# Altium schematic sheet Digpot_load_cell_alim.SchDoc
size A; SheetNumber: 1; SheetTotal: 7
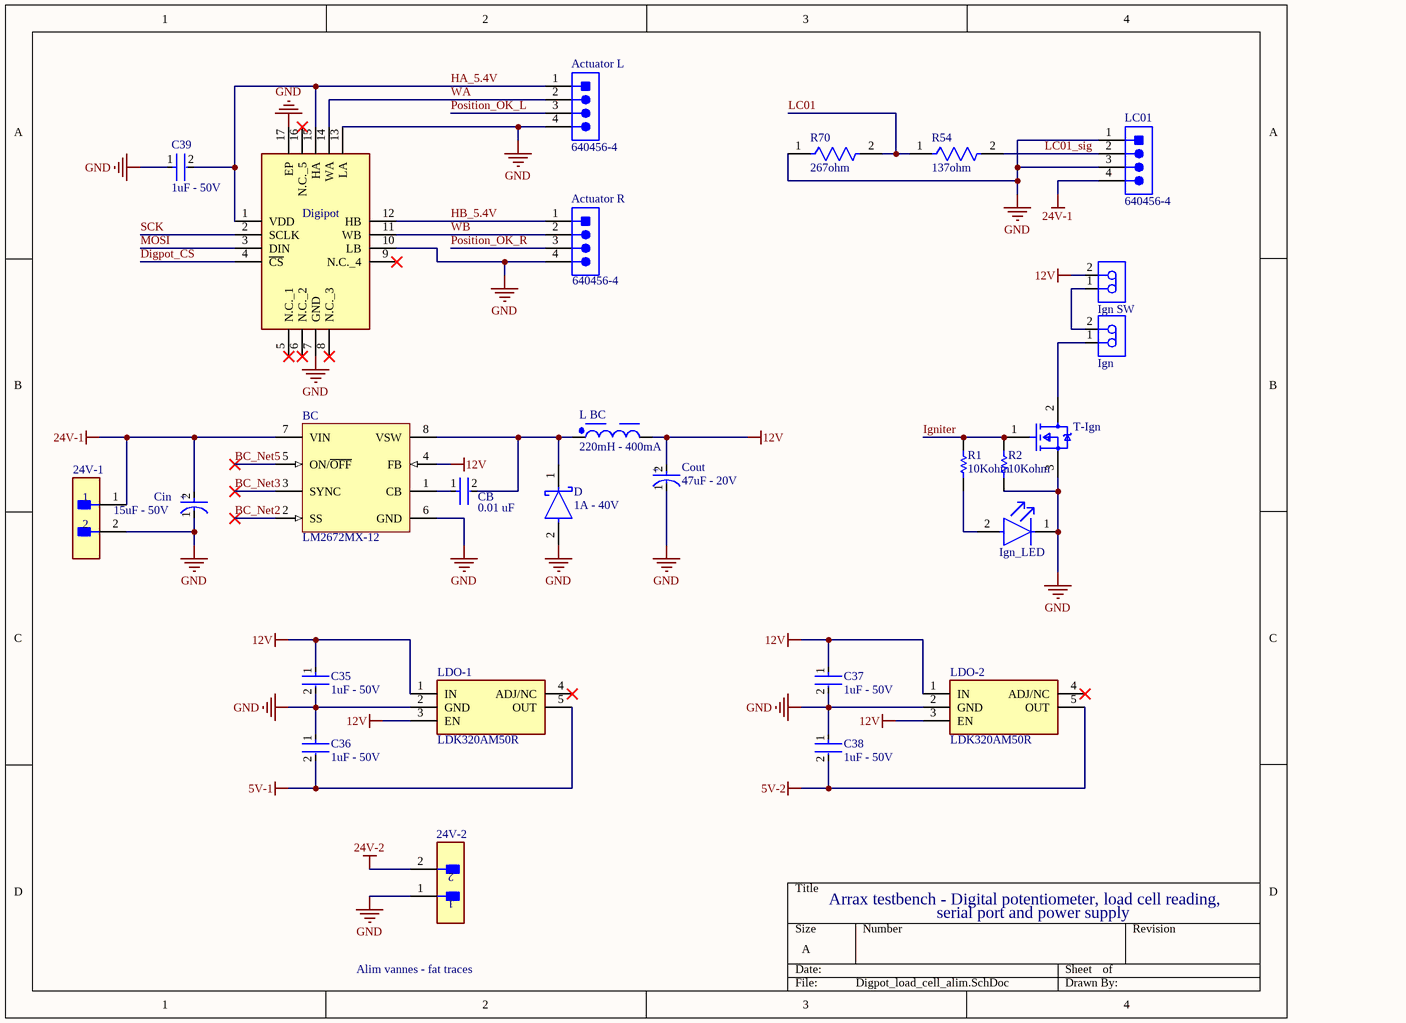
[diagram p0: Digpot_load_cell_alim.SchDoc]

## Parts
24V-1  (no value)  [FP-B2P-VH-FB-B_LF_SN-MFG]
24V-2  (no value)  [FP-B2P-VH-FB-B_LF_SN-MFG]
Actuator_L  640456-4  [TECO-640456-4]
Actuator_R  640456-4  [TECO-640456-4]
BC  LM2672MX-12  [M08A_L]
C35  1uF - 50V  [FP-0805-L_2_0_0_1-W_1_25-MFG]
C36  1uF - 50V  [FP-0805-L_2_0_0_1-W_1_25-MFG]
C37  1uF - 50V  [FP-0805-L_2_0_0_1-W_1_25-MFG]
C38  1uF - 50V  [FP-0805-L_2_0_0_1-W_1_25-MFG]
C39  1uF - 50V  [FP-0805-L_2_0_0_1-W_1_25-MFG]
CB  0.01 uF  [FP-CC0805-0_85-MFG]
Cin  15uF - 50V  [FP-TAJD-MFG]
Cout  47uF - 20V  [FP-TAJD-MFG]
D  1A - 40V  [FP-SOD-323-IPC_C]
Digipot  TPL0202-10MRTER  [QFN50P300X300X80-17N-D]  (value not drawn)
Ign  640456-2  [TECO-640456-2_V]  (value not drawn)
Ign_LED  LS R976-NR-1  [FP-LS_R976-MFG]  (value not drawn)
Ign_SW  640456-2  [TECO-640456-2_V]  (value not drawn)
L_BC  220mH - 400mA  [WE-LQFS_4828]
LC01  640456-4  [TECO-640456-4]
LDO-1  LDK320AM50R  [SOT95P280X145-5N]
LDO-2  LDK320AM50R  [SOT95P280X145-5N]
R1  10Kohm  [RESC2013X60X30NL20T20]
R2  10Kohm  [RESC2013X60X30NL20T20]
R54  137ohm  [FP-RP73P-2A-MFG]
R70  267ohm  [FP-RP73P-2A-MFG]
T-Ign  IRLZ44NPbF  [FP-PG-TO220-3-MFG]  (value not drawn)

## Nets
5V-1: C36.2 LDO-1.5(OUT)
5V-2: C38.2 LDO-2.5(OUT)
12V: BC.4(FB) C35.1 C37.1 Cout.2(A) Ign_SW.2 L_BC.2 LDO-1.1(IN) LDO-1.3(EN) LDO-2.1(IN) LDO-2.3(EN)
24V-1: 24V-1.1 BC.7(VIN) Cin.2(A) LC01.4
24V-2: 24V-2.2
GND: 24V-1.2 24V-2.1 Actuator_L.4 Actuator_R.4 BC.6(GND) C35.2 C36.1 C37.2 C38.1 C39.1 Cin.1(C) Cout.1(C) D.2(A) Digipot.7(GND) Digipot.10(LB) Digipot.13(LA) Digipot.17(EP) Ign_LED.1(C) LC01.1 LC01.3 LDO-1.2(GND) LDO-2.2(GND) R2.1 R70.1 T-Ign.3(S)
BC_Net2: BC.2(SS)
BC_Net3: BC.3(SYNC)
BC_Net5: BC.5(ON/~{OFF})
Digpot_CS: Digipot.4(~{CS})
HA_5.4V: Actuator_L.1 C39.2 Digipot.1(VDD) Digipot.15(HA)
HB_5.4V: Actuator_R.1 Digipot.12(HB)
Igniter: R1.2 R2.2 T-Ign.1(G)
LC01: R54.1 R70.2
LC01_sig: LC01.2 R54.2
MOSI: Digipot.3(DIN)
Position_OK_L: Actuator_L.3
Position_OK_R: Actuator_R.3
SCK: Digipot.2(SCLK)
WA: Actuator_L.2 Digipot.14(WA)
WB: Actuator_R.2 Digipot.11(WB)
NetBC_1: BC.1(CB) CB.1
NetBC_8: BC.8(VSW) CB.2 D.1(C) L_BC.1
NetIgn_1: Ign.1 T-Ign.2(D)
NetIgn_2: Ign.2 Ign_SW.1
NetIgn_LED_2: Ign_LED.2(A) R1.1

Not connected (* = marked no-connect by the designer): Digipot 5(N.C._1)* 6(N.C._2)* 8(N.C._3)* 9(N.C._4)* 16(N.C._5)*; LDO-1 4(ADJ/NC)*; LDO-2 4(ADJ/NC)*

## Notes on the sheet
- Arrax testbench - Digital potentiometer, load cell reading,
- Alim vannes - fat traces
- serial port and power supply
- (in symbol CMP-04424-000207-1) +
- (in symbol CMP-04424-000546-1) +

## Library data of the parts
24V-1 24V-2 = CMP-17439-000031-1: CONN HEADER VERT 2POS 3.96MM; Connector Type: Male Pin; Pitch: 0.156inch; Number of Positions: 2; Packaging: Bulk; Package Quantity: 250; Termination: Solder; Lead Free: Lead Free; Contact Plating: Tin; Contact Type: Male Pin; Color: Natural; Fastening Type: Ramp; Number of Rows: 1; Mount: Through Hole; Series: VH
Actuator_L Actuator_R LC01 = CMP-2000-05419-1: Male Header, Pitch 2.54 mm, 1 x 4 Position, Height 10.03 mm, Tail Length 3.56 mm, RoHS, Bulk; Manufacturer: TE Connectivity; Material, Housing: Polyester; Primary Type: InterconnectSystem; Mount Angle: Vertical; Color, Housing: White; Current, Rating: 5 / A; Agency Approvals: CSA,UL; Contact Termination Area Plating: Tin; Temperature, Operating: -55to+105 / degC; Standards: RoHSCompliant,ELVCompliant,UL94V-0; Number of Positions: 4; Brand/Series: MTA-100Series; Angle: Straight; Pin Spacing: 0.1 / "; Material, Contact: CopperAlloy; Connector Type: MTA-100; Special Features: Pinstrip; Mounting Hole Size: 0.04 / "; Contact Centerline Spacing: 0.100 / in.; Voltage, Rating: 250 / V; Manufacturer URL: http://www.te.com/; Length, Pin: 0.14 / "; Length, Overall: 0.4 / "; Color: White; Flammability Rating: UL94V-0; Mounting Type: PCMount; Termination: Solder; Datasheet URL: https://datasheet.ciiva.com/16286/eng-ds-82056-mta-0608-16286228.pdf; Number of Contacts: 4; Contact Shape: Square; Contact Mating Area Plating: Tin; Length, Terminal Post: 0.14 / in.; Size, Post: 0.025 / in.; Contact Plating: Tin; Type: PCBPlug; Datasheet Version: Dec-14; Number of Rows: 1
BC = CMP-0069-00660-2: SIMPLE SWITCHER® Power Converter High Efficiency 1A Step-Down Voltage Regulator with Features, 8-pin Narrow SOIC; Manufacturer: National Semiconductor; PackageTopMarking: NSZXTT*2672*M-12; PowerWise: N; ComponentLink2URL: http://www.national.com/pf/LM/LM2672.html; ComponentLink2Description: LM2672 Web Page; RoHS: N; PinCount: 8; Code_JEDEC: MS-012-AA; PackageDescription: SOIC Narrow, 4.9 x 3.9 x 1.45mm, 8 Lead, 1.27mm Pitch; PackageReference: M08A; ComponentLink3Description: M08A Package Page; RevisionNote: Component URLs added; Code_IPC: SOIC127P600-8; PackageVersion: revM, May-2009; ComponentLink1URL: http://www.national.com/ds/LM/LM2672.pdf; DatasheetVersion: Apr-2007; ComponentLink3URL: http://www.national.com/packaging/folders/m08a.html; ComponentLink1Description: LM2672 Datasheet; CompType: Switcher
C35-C39 = CMP-14477-005239-2: Multilayer Ceramic Capacitor 1 uF 50V X7R 10% SMD 0805 Automotive T/R; Packaging: Tape and Reel; Width: 1.2mm; Height: 1.25mm; Package Quantity: 3000; Min Operating Temperature: -55°C; Thickness: 0.053inch; Case/Package: 0805; Weight: 0.000194oz; Dielectric: X7R; Halogen Free: Halogen Free; Tolerance: 10%; Ratings: AEC-Q200; RoHS Compliant: Yes; Voltage Rating (DC): 50V; Capacitance: 1uF; Series: M; Length: 2mm; Mount: Surface Mount; Max Operating Temperature: 125°C; Voltage Rating: 50V; Case Code (Imperial): 0805; Case Code (Metric): 2012; Termination: SMD/SMT
CB = CMP-1036-03842-3: CAP CER 10000PF 50V X7R 0805; Manufacturer: Yageo; Manufacturer Part Number: CC0805KRX7R9BB103; Capacitance: 10 nF; Value: 10 nF; Tolerance: 0.1; Footprint Url: http://www.yageo.com/exep/pages/download/literatures/UPY-C_GEN_24.pdf; Material: Ceramic; Temperature Characteristic: X7R; ComponentLink2Description: Datasheet; Lead Free: Yes; Height: 0.95mm; Temperature Range High: +85°C; Automotive: No; Octopart: https://octopart.com/cc0805krx7r9bb103-yageo-192989; Device Class L1: Passive Components; Mouser Description: Multilayer Ceramic Capacitors MLCC - SMD/SMT 10nF 50V X7R 10%; Temperature: -30°C to +85°C; Device Class L2: Capacitors; Ipc Land Pattern Name: CAPC200125X85; Device Class L3: Ceramic Capacitors; Temperature Range Low: -30°C; RoHS: TRUE; Voltage Rating: 50 V; Package: CC0805-0.85; Category: Cap; ComponentLink2URL: http://www.yageo.com/documents/recent/UPY-GPHC_Y5V_6.3V-to-50V_8.pdf; Digikey Description: CAP CER 10000PF 50V X7R 0805
Cin = CMP-04424-000546-1: 15uF 50V  ±10% 600mΩ 2917  SMD Tantalum Capacitor; Leakage Current: 7.5uA; ESR (Equivalent Series Resistance): 600mR; Dissipation Factor: 6%; Polarity: Polar; RoHS Compliant: Yes; Packaging: Tape and Reel; Features: General Purpose; Dielectric Material: Tantalum; Case/Package: 2917; Case Code (Imperial): 2917; Max Operating Temperature: 125°C; Construction: Flat; Width: 0.169inch; Height - Seated (Max): 0.122inch; Lead Free: Lead Free; Capacitance: 15uF; Mount: Surface Mount; Depth: 4.3mm; Series: TAJ; Case Code (Metric): 7343; Voltage Rating: 50V; Termination: SMD/SMT; Min Operating Temperature: -55°C; Tolerance: 10%; Package Quantity: 500; Radiation Hardening: No; Height: 3.1mm; Length: 7.3mm; REACH SVHC: No SVHC; Lead Pitch: 4.4mm
Cout = CMP-04424-000207-1: 47uF 20V  ±10% 900mΩ 2917  SMD Tantalum Capacitor; Leakage Current: 9.4uA; Dissipation Factor: 6%; ESR (Equivalent Series Resistance): 900mR; Polarity: Polar; Width: 4.3mm; REACH SVHC: No SVHC; Voltage Rating (DC): 20V; RoHS Compliant: Yes; Height: 2.9mm; Case Code (Metric): 7343; Case Code (Imperial): 2917; Length: 7.3mm; Packaging: Tape and Reel; Series: TAJ; Lead Free: Lead Free; Voltage Rating: 20V; Max Operating Temperature: 125°C; Package Quantity: 1; Case/Package: 2917; Capacitance: 47uF; Tolerance: 10%; Dielectric Material: Tantalum; Depth: 4.3mm; Features: General Purpose; Min Operating Temperature: -55°C; Radiation Hardening: No; Height - Seated (Max): 0.122inch; Mount: Surface Mount; Voltage: 20V; Construction: Flat; Termination: SMD/SMT
D = CMP-56206-000009-1: DIODE SCHOTTKY 40V 1A SOD323; Max Reverse Leakage Current: 1mA; Peak Non-Repetitive Surge Current: 10A; Forward Voltage: 900mV; Element Configuration: Single; Max Reverse Voltage (DC): 40V; Number of Pins: 2; Max Operating Temperature: 125°C; Package Quantity: 1; Radiation Hardening: No; Average Rectified Current: 1A; Lead Free: Lead Free; Series: -; Mount: Surface Mount; Min Operating Temperature: -65°C; RoHS Compliant: Yes; Packaging: Tape and Reel; Max Surge Current: 10A
Digipot = TPL0202-10MRTER: Integrated Circuit; Manufacturer_Name: Texas Instruments; Datasheet Link: http://www.ti.com/lit/gpn/tpl0202-10; Height: 0.8mm; Manufacturer_Part_Number: TPL0202-10MRTER; Mouser Part Number: 595-TPL0202-10MRTER; Mouser Price/Stock: https://www.mouser.co.uk/ProductDetail/Texas-Instruments/TPL0202-10MRTER?qs=O1HRStiETCjiIaUc6hg4xg%3D%3D; Arrow Part Number: TPL0202-10MRTER; Arrow Price/Stock: https://www.arrow.com/en/products/tpl0202-10mrter/texas-instruments
Ign Ign_SW = CMP-2000-05417-1: Male Header, Pitch 2.54 mm, 1 x 2 Position, Height 10.49 mm, Tail Length 3.556 mm, -55 to 105 degC, RoHS, Bulk; Manufacturer: TE Connectivity; Standards: RoHSCompliant,ELVCompliant,UL94V-0; Material, Housing: Polyester; Agency Approvals: CSA,UL; Brand/Series: MTA-100Series; Contact Centerline Spacing: 0.100 / in.; Material, Contact: CopperAlloy; Current, Rating: 5 / A; Color, Housing: White; Contact Termination Area Plating: Tin; Special Features: Pinstrip; Number of Positions: 2; Pin Spacing: 0.1 / "; Temperature, Operating: -55to+105 / degC; Angle: Straight; Mount Angle: Vertical; Connector Type: MTA-100; Primary Type: InterconnectSystem; Voltage, Rating: 250 / V; Mounting Hole Size: 0.04 / "; Number of Rows: 1; Termination: Solder; Length, Terminal Post: 0.14 / in.; Manufacturer URL: http://www.te.com/; Color: White; Size, Post: 0.025 / in.; Contact Shape: Square; Mounting Type: PCMount; Datasheet URL: https://datasheet.ciiva.com/11746/0900766b80eb7fdd-11746365.pdf; Type: PCBPlug; Datasheet Version: Rev. W, 06/2004; Number of Contacts: 2; Flammability Rating: UL94V-0; Contact Plating: Tin; Length, Pin: 0.14 / "; Contact Mating Area Plating: Tin; Length, Overall: 0.2 / "
Ign_LED = CMP-62016-000037-1: LED RED DIFFUSED 0805 SMD; Lens Size: 1.25mm; Number of LEDs: 1; Luminous Intensity: 180mcd; Dominant Wavelength: 633nm; Lens Style: Flat; Reverse Voltage: 12V; Lens Color: White; Forward Voltage: 2.5V; Forward Current: 25mA; Power Dissipation: 65W; Luminous Flux: 0.47lm; Test Current: 20mA; Viewing Angle: 160°; Length: 2mm; Number of Pins: 2; Lens Transparency: Diffused; Min Operating Temperature: -30°C; Case Code (Metric): 2012; Depth: 1.35mm; Color: Red; Illumination Color: Red; Max Operating Temperature: 85°C; Mount: Surface Mount; Case/Package: 0805; Height: 0.9mm; Package Quantity: 16000; Number of Elements: 1; Radiation Hardening: No; Case Code (Imperial): 0805; Packaging: Tape and Reel; Width: 1.25mm
L_BC = CMP-03913-77814927-1: 74406043221 Fixed Ind 220UH 400MA 1.326 Ohm; DC Resistance (DCR): 1.105Ω; Inductance Tolerance: 20%; Inductance: 220µH; RoHS: Compliant; Ambient Temperature Range High: 85°C; Ambient Temperature Range Low: -40°C; Min Operating Temperature: -40°C; Length: 4.8mm; Current Rating: 400mA; NexarPartId: 77814927; Height: 2.8mm; Width: 4.8mm; Max Operating Temperature: 125°C
LDO-1 LDO-2 = LDK320AM50R: Integrated Circuit; Manufacturer_Name: STMicroelectronics; Datasheet Link: http://www.st.com/resource/en/datasheet/ldk320.pdf; Height: 1.45mm; Manufacturer_Part_Number: LDK320AM50R; Mouser Part Number: 511-LDK320AM50R; Mouser Price/Stock: https://www.mouser.co.uk/ProductDetail/STMicroelectronics/LDK320AM50R?qs=dTJS0cRn7ohMsVcu3TlL4w%3D%3D; Arrow Part Number: LDK320AM50R; Arrow Price/Stock: https://www.arrow.com/en/products/ldk320am50r/stmicroelectronics?region=nac
R1 R2 = CMP-2001-01994-1: Manufacturer: KOA Speer; Part Number: RK73H2ATTD1003F
R54 = CMP-03211-001043-1: RP73P 0805 137Ω 0.25W 25ppm/°C 0.10% 150V; Manufacturer Part Number: RP73PF2A137RBTDF; Manufacturer: TE Connectivity; Tolerance: 0.001; Temperature Coefficient: 25ppm/°C; Composition: Thin Film; Temperature Range High: +155°C; Automotive: No; Ipc Land Pattern Name: RESC200125X55; Lead Free: Yes; Device Class L2: Resistors; Temperature: -55°C to +155°C; Resistance: 137Ω; Series: RP73P; Category: Res; Temperature Range Low: -55°C; RoHS: TRUE; Voltage Rating: 150V; Value: 137Ω; Height: 0.65mm; ComponentLink2URL: https://www.te.com/commerce/DocumentDelivery/DDEController?Action=srchrtrv&DocNm=1773272&DocType=DS&DocLang=English; Package: RP73P-2A; Power Rating: 0.25W; ComponentLink2Description: Datasheet; Device Class L1: Passive Components; Device Class L3: Chip SMD Resistors; Octopart: https://octopart.com/rp73pf2a137rbtdf-te+connectivity-45466427
R70 = CMP-03211-003395-1: RP73P 0805 267Ω 0.25W 25ppm/°C 0.10% 150V; Manufacturer Part Number: RP73PF2A267RBTDF; Manufacturer: TE Connectivity; Tolerance: 0.001; RoHS: TRUE; Composition: Thin Film; Device Class L1: Passive Components; Temperature Coefficient: 25ppm/°C; Height: 0.65mm; Temperature Range Low: -55°C; Category: Res; Temperature Range High: +155°C; Value: 267Ω; Device Class L2: Resistors; Lead Free: Yes; ComponentLink2Description: Datasheet; ComponentLink2URL: https://www.te.com/commerce/DocumentDelivery/DDEController?Action=srchrtrv&DocNm=1773272&DocType=DS&DocLang=English; Device Class L3: Chip SMD Resistors; Voltage Rating: 150V; Power Rating: 0.25W; Automotive: No; Series: RP73P; Ipc Land Pattern Name: RESC200125X55; Package: RP73P-2A; Temperature: -55°C to +155°C; Octopart: https://octopart.com/rp73pf2a267rbtdf-te+connectivity-45466701; Resistance: 267Ω
T-Ign = CMP-32901-000488-1: MOSFET N-CH 55V 47A TO220AB; Turn-On Delay Time: 11ns; Gate to Source Voltage (Vgs): 16V; Element Configuration: Single; Rds On Max: 22mR; Turn-Off Delay Time: 26ns; Max Power Dissipation: 110W; Threshold Voltage: 2V; Drain to Source Resistance: 35mR; Input Capacitance: 1.7nF; Continuous Drain Current (ID): 47A; Case/Package: TO-220; Lead Free: Lead Free; Halogen Free: Halogen Free; Packaging: Rail/Tube; Length: 0.414inch; Min Operating Temperature: -55°C; REACH SVHC: No SVHC; Number of Pins: 3; Width: 0.185inch; Drain to Source Voltage (Vdss): 55V; Power Dissipation: 110W; RoHS Compliant: Yes; Max Operating Temperature: 175°C; Height: 0.6inch; Max Dual Supply Voltage: 55V; Drain to Source Breakdown Voltage: 55V; Mount: Through Hole